# Altium schematic sheet NEB_AUDIO_OUT.SCHDOC
size A4; Organization: Altium Limited; Address1: L3, 12a Rodborough Rd; Address2: Frenchs Forest; Address3: NSW; Address4: Australia 2086; DocumentNumber: 4; SheetNumber: 4; SheetTotal: 10
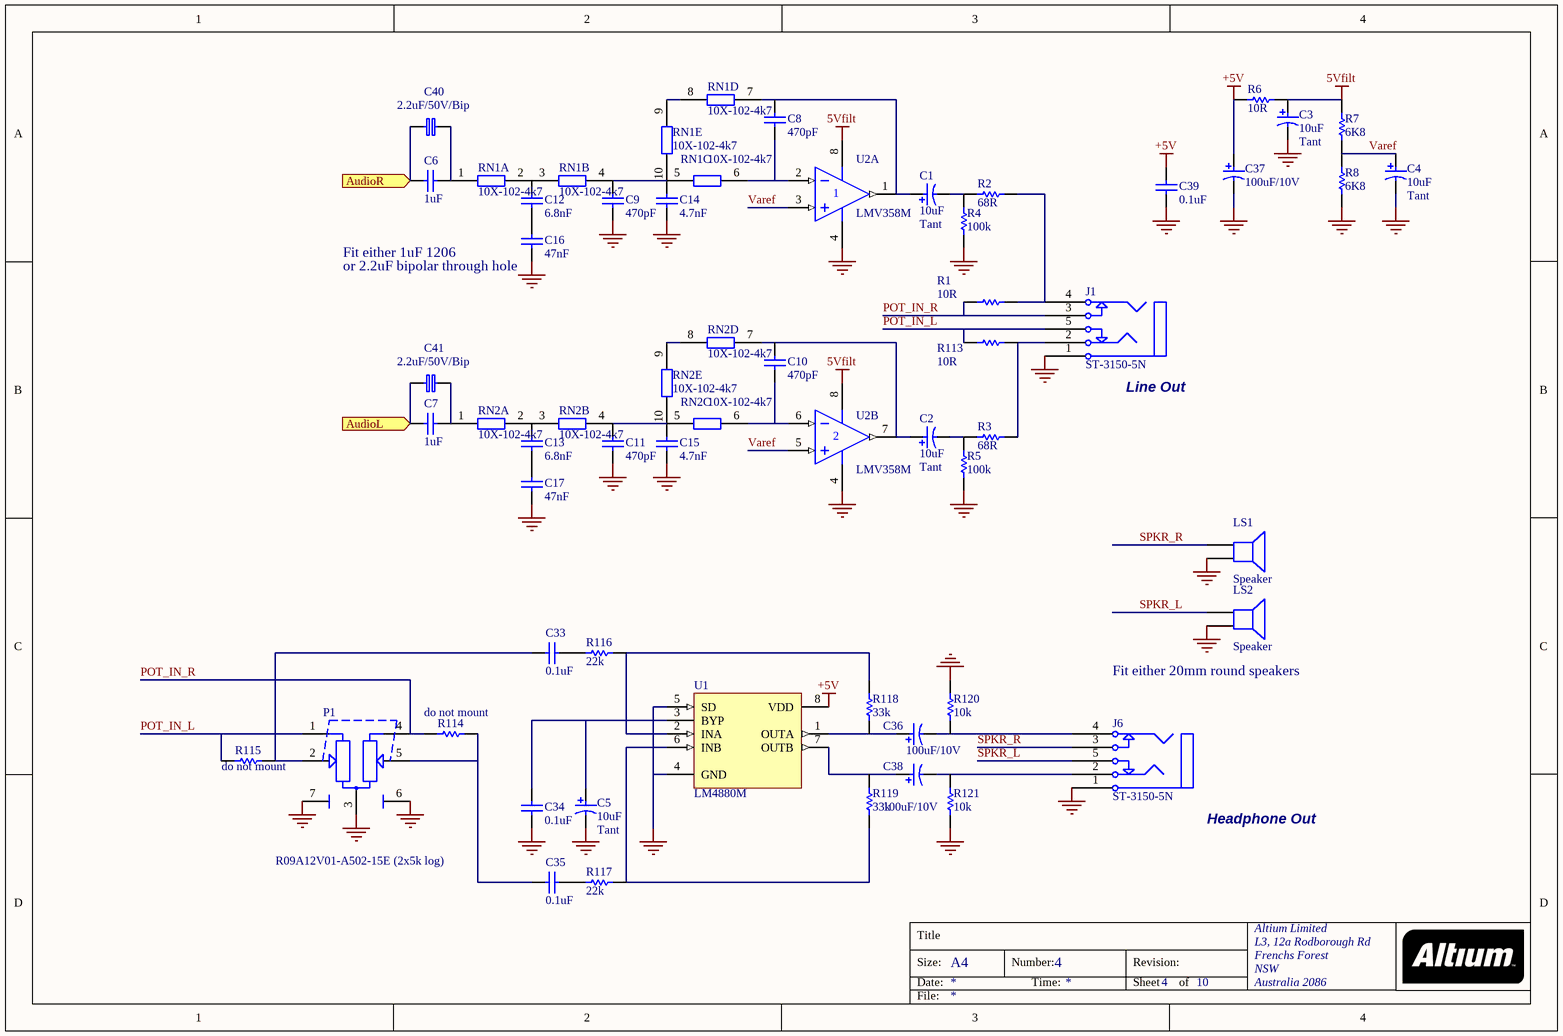
[diagram p0: NEB_AUDIO_OUT.SCHDOC]

## Parts
C1  10uF  Capacitor Type: Tant  [MCCT-B]
C2  10uF  Capacitor Type: Tant  [MCCT-B]
C3  10uF  Capacitor Type: Tant  [MCCT-B]
C4  10uF  Capacitor Type: Tant  [MCCT-B]
C5  10uF  Capacitor Type: Tant  [MCCT-B]
C6  1uF  [CC3216-1206]
C7  1uF  [CC3216-1206]
C8  470pF  [CC2012-0805]
C9  470pF  [CC2012-0805]
C10  470pF  [CC2012-0805]
C11  470pF  [CC2012-0805]
C12  6.8nF  [CC2012-0805]
C13  6.8nF  [CC2012-0805]
C14  4.7nF  [CC2012-0805]
C15  4.7nF  [CC2012-0805]
C16  47nF  [CC2012-0805]
C17  47nF  [CC2012-0805]
C33  0.1uF  [CC2012-0805]
C34  0.1uF  [CC2012-0805]
C35  0.1uF  [CC2012-0805]
C36  100uF/10V  [CAP D5mm/P2mm]
C37  100uF/10V  [CAP D5mm/P2mm]
C38  100uF/10V  [CAP D5mm/P2mm]
C39  0.1uF  [CC2012-0805]
C40  2.2uF/50V/Bip  [CAP D5mm/P2mm]
C41  2.2uF/50V/Bip  [CAP D5mm/P2mm]
J1  ST-3150-5N  [ST-3150-5N]
J6  ST-3150-5N  [ST-3150-5N]
LS1  Speaker  [PIN2]
LS2  Speaker  [PIN2]
P1  R09A12V01-A502-15E (2x5k log)  [R09A12V01-E]
R1  10R  [CR2012-0805]
R2  68R  [CR2012-0805]
R3  68R  [CR2012-0805]
R4  100k  [CR2012-0805]
R5  100k  [CR2012-0805]
R6  10R  [CR2012-0805]
R7  6K8  [CR2012-0805]
R8  6K8  [CR2012-0805]
R113  10R  [CR2012-0805]
R114  do not mount  [CR2012-0805]
R115  do not mount  [CR2012-0805]
R116  22k  [CR2012-0805]
R117  22k  [CR2012-0805]
R118  33k  [CR2012-0805]
R119  33k  [CR2012-0805]
R120  10k  [CR2012-0805]
R121  10k  [CR2012-0805]
RN1  10X-102-4k7  [SIL-10/X1.2]  (parts A,B,C,D,E of 5)
RN2  10X-102-4k7  [SIL-10/X1.2]  (parts A,B,C,D,E of 5)
U1  LM4880M  [M08A]
U2  LMV358M  [M08A]  (parts A,B of 2)

## Ports
AudioL (in), AudioR (in)

## Nets
5Vfilt: C3.1 R6.1 R7.1 U2.8(V+)
+5V: C37.1 C39.2 R6.2 U1.8(VDD)
GND: C3.2 C4.2 C5.2 C9.1 C11.1 C14.1 C15.1 C16.1 C17.1 C34.1 C37.2 C39.1 J1.1 J1.1A J1.1B J6.1 J6.1A J6.1B LS1.2 LS2.2 P1.3 P1.6 P1.7 R4.2 R5.2 R8.2 R120.1 R121.1 U1.4(GND) U1.5(SD) U2.4(V-)
AudioL: C7.1 C41.1 ; port AudioL
AudioR: C6.1 C40.1 ; port AudioR
POT_IN_L: J1.5 J1.5A J1.5B P1.1 R113.2 R115.1
POT_IN_R: J1.3 J1.3A J1.3B P1.4 R1.2 R114.1
SPKR_L: J6.5 J6.5A J6.5B LS2.1
SPKR_R: J6.3 J6.3A J6.3B LS1.1
Varef: C4.1 R7.2 R8.1 U2.3(IN+) U2.5(IN+)
NetC1_1: C1.1 C8.2 RN1.7 U2.1(OUT)
NetC1_2: C1.2 R2.1 R4.1
NetC2_1: C2.1 C10.2 RN2.7 U2.7(OUT)
NetC2_2: C2.2 R3.1 R5.1
NetC5_1: C5.1 C34.2 U1.3(BYP)
NetC6_2: C6.2 C40.2 RN1.1
NetC7_2: C7.2 C41.2 RN2.1
NetC8_1: C8.1 RN1.6 U2.2(IN-)
NetC9_2: C9.2 C14.2 RN1.4 RN1.5 RN1.10
NetC10_1: C10.1 RN2.6 U2.6(IN-)
NetC11_2: C11.2 C15.2 RN2.4 RN2.5 RN2.10
NetC12_1: C12.1 C16.2
NetC12_2: C12.2 RN1.2 RN1.3
NetC13_1: C13.1 C17.2
NetC13_2: C13.2 RN2.2 RN2.3
NetC33_1: C33.1 P1.2 R115.2
NetC33_2: C33.2 R116.1
NetC35_1: C35.1 P1.5 R114.2
NetC35_2: C35.2 R117.1
NetC36_1: C36.1 R118.2 U1.1(OUTA)
NetC36_2: C36.2 J6.4 J6.4A J6.4B R120.2
NetC38_1: C38.1 R119.2 U1.7(OUTB)
NetC38_2: C38.2 J6.2 J6.2A J6.2B R121.2
NetJ1_2: J1.2 J1.2A J1.2B R3.2 R113.1
NetJ1_4: J1.4 J1.4A J1.4B R1.1 R2.2
NetR116_2: R116.2 R118.1 U1.2(INA)
NetR117_2: R117.2 R119.1 U1.6(INB)
NetRN1_8: RN1.8 RN1.9
NetRN2_8: RN2.8 RN2.9

## Notes on the sheet
- Fit either 1uF 1206
- (near C16) or 2.2uF bipolar through hole
- (near J1) Line Out
- Fit either 20mm round speakers
- (near J6) Headphone Out
- Title
- Size:
- Date:
- A4
- Number:
- Time:
- Revision:
- Sheet
- of
- File:

## Library data of the parts
C1-C5 = CAP_POLAR: Polar Capacitor; Fitted: True; Supplier: FARNELL; Supplier Code: 967-117
C6-C17 C33-C35 C39 = CAP: Capacitor; Fitted: True
  C6 C7: Supplier: FARNELL; Supplier Code: 476-4160
  C12 C13: Supplier: FARNELL; Supplier Code: 301-9925
  C14 C15: Supplier: FARNELL; Supplier Code: 301-9913
  C16 C17: Supplier: FARNELL; Supplier Code: 644-146
  C33: Supplier: FARNELL; Supplier Code: 476-4500
C36 C38 = CAP_POLAR: Polar Capacitor; Capacitor Type: Electro; Fitted: True; Supplier: FARNELL; Supplier Code: 361-8390
C37 = CAP_POLAR: Polar Capacitor; Capacitor Type: Bipolar; Fitted: True; Supplier: FARNELL; Supplier Code: 361-8390
C40 C41 = CAP Electro Bipolar: Electrolytic Bipolar Capacitor; Supplier: FARNELL; Supplier Code: 383-7099
J1 J6 = ST-3150-5N: 3-Conductor Jack with 2 break contacts (normals) and 2 auxiliary make contacts; Manufacturer: Kycon; Class I: Connector; Fitted: True; Revision: December-2003: Created for NanoBoard.; Publisher: Altium Limited
LS1 LS2 = Speaker: Loudspeaker; Published: 24-Mar-1999; Revision: 17-Jul-2002: Re-released for DXP Platform.; Publisher: Altium Limited
P1 = POT Dual Gang Shield: Sunrise Company Stereo Pot
R1-R8 R113-R121 = RES: Resistor; Fitted: True
RN1 RN2 = 10X-102: Resistor network SIL 5 individual resistors, 10 pins; Supplier: FARNELL; Supplier Code: 447-572
U1 = LM4880M: Dual 250mW Audio Amplifier with Shutdown Mode; Package Information: Latest Revision: Sep-1997; Code - JEDEC: MS-012-AA; Code - IPC: SO8; Published: 15-Apr-2002; Datasheet: Latest Revision: Nov-1995; Package Reference: M08A; Publisher: Altium Limited
U2 = LMV358M: Dual General-Purpose, Low-Voltage Rail-to-Rail Output Operational Amplifier; Package Information: Latest Revision: Sep-1997; Code - JEDEC: MS-012-AA; Code - IPC: SO8; Published: 15-Apr-2002; Datasheet: Latest Revision: Aug-1999; Package Reference: M08A; Publisher: Altium Limited